# Altium schematic sheet power_board.SchDoc: Power Board Roberto
size A4; Date: 14.04.2014; Author: Benjamin Bonnal; CompanyName: Robopoly; DrawnBy: Benjamin Bonnal; Engineer: Benjamin Bonnal; Organization: Robopoly; Revision: 1.0; SheetNumber: 1; SheetTotal: 1
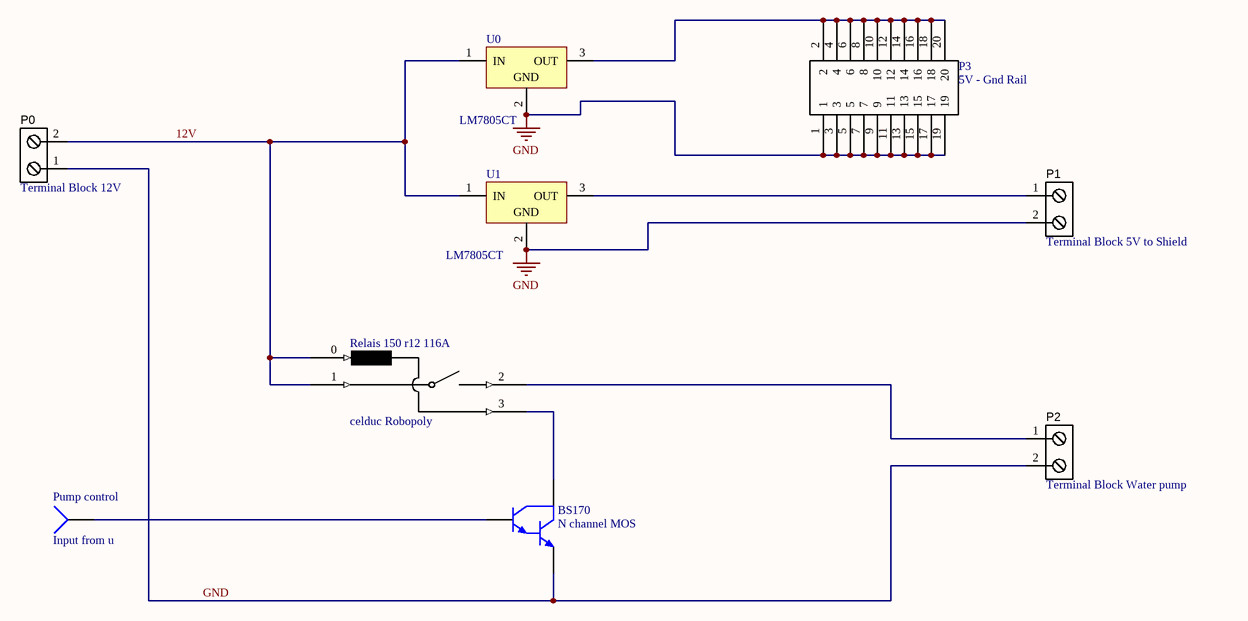
[diagram p0: power_board.SchDoc]

## Parts
BS170  N channel MOS  [TO-92]
P0  Terminal Block 12V  [Phoenix PT 2-Pole]
P1  Terminal Block 5V to Shield  [Phoenix PT 2-Pole]
P2  Terminal Block Water pump  [Phoenix PT 2-Pole]
P3  5V - Gnd Rail  [HEADER 10x2]
Pump_control  Input from u  [PIN1]
Relais_150_r12_116A  celduc Robopoly  [Relais 150 r12 116A]
U0  LM7805CT  [T03B]
U1  LM7805CT  [T03B]

## Nets
GND: BS170.3(E) P0.1 P1.2 P2.2 P3.1 P3.3 P3.5 P3.7 P3.9 P3.11 P3.13 P3.15 P3.17 P3.19 U0.2(GND) U1.2(GND)
12V: P0.2 Relais_150_r12_116A.0(CoilIn) Relais_150_r12_116A.1(SwitchIn) U0.1(IN) U1.1(IN)
NetBS170_1: BS170.1(C) Relais_150_r12_116A.3(CoilOut)
NetBS170_2: BS170.2(B) Pump_control.1
NetP1_1: P1.1 U1.3(OUT)
NetP2_1: P2.1 Relais_150_r12_116A.2(SwitchOut)
NetP3_2: P3.2 P3.4 P3.6 P3.8 P3.10 P3.12 P3.14 P3.16 P3.18 P3.20 U0.3(OUT)

## Notes on the sheet
- Title
- Size:
- Date:
- A4
- Number:
- Time:
- Revision:
- Sheet
- of
- File:

## Library data of the parts
BS170 = NPN1: N channel MOSfet; Published: 8-Jun-2000; LatestRevisionDate: 17-Jul-2002; LatestRevisionNote: Re-released for DXP Platform.; DatasheetVersion: 1989; PackageVersion: 1989; PackageReference: TO-92; Publisher: Altium Limited; PackageDescription: TO, Flat Index; 3 In-Line, Axial Leads; Body Dia. 4.6mm; Leads 0.41 x 0.39 mm (max); Code_JEDEC: TO-92
P0-P2 = Screw Block 2: 2-Pin Screw Terminal; LatestRevisionDate: 17-Jul-2002; LatestRevisionNote: Re-released for DXP Platform.; Publisher: Altium Limited
P3 = HEADER 10x2: Header, 2-Pin; LatestRevisionDate: 17-Jul-2002; LatestRevisionNote: Re-released for DXP Platform.; Publisher: Altium Limited
Pump_control = Socket: LatestRevisionDate: 17-Jul-2002; LatestRevisionNote: Re-released for DXP Platform.; Publisher: Altium Limited
Relais_150_r12_116A = Relai celduc Robopoly: Relais
U0 U1 = LM7808CT: Series 3-Terminal Positive Regulators, 3-pin TO-220; Manufacturer: National Semiconductor; PackageTopMarking: NSUZXYTTE#*LM7808CT; CompType: LDO IC; Published: 4-Dec-2008; DatasheetVersion: Jul-2006; PackageVersion: revL, Jan-1992; PackageReference: T03B; Publisher: Altium Limited; PackageDescription: TO-220, Molded, 3 Lead, Straight; Supplier 1: Farnell; Supplier Part Number 1: 9490248; PartNumber: LM7808CT; RoHS: O; PinCount: 3; ComponentLink1Description: LM340 Datasheet; ComponentLink1URL: http://www.national.com/ds/LM/LM340.pdf; ComponentLink2Description: LM340 Web Page; ComponentLink2URL: http://www.national.com/pf/LM/LM340.html; ComponentLink3Description: T03B Package Page; ComponentLink3URL: http://www.national.com/packaging/folders/t03b.html